# EAGLE design 32nbIoTrpi (EAGLE 9.0.0)
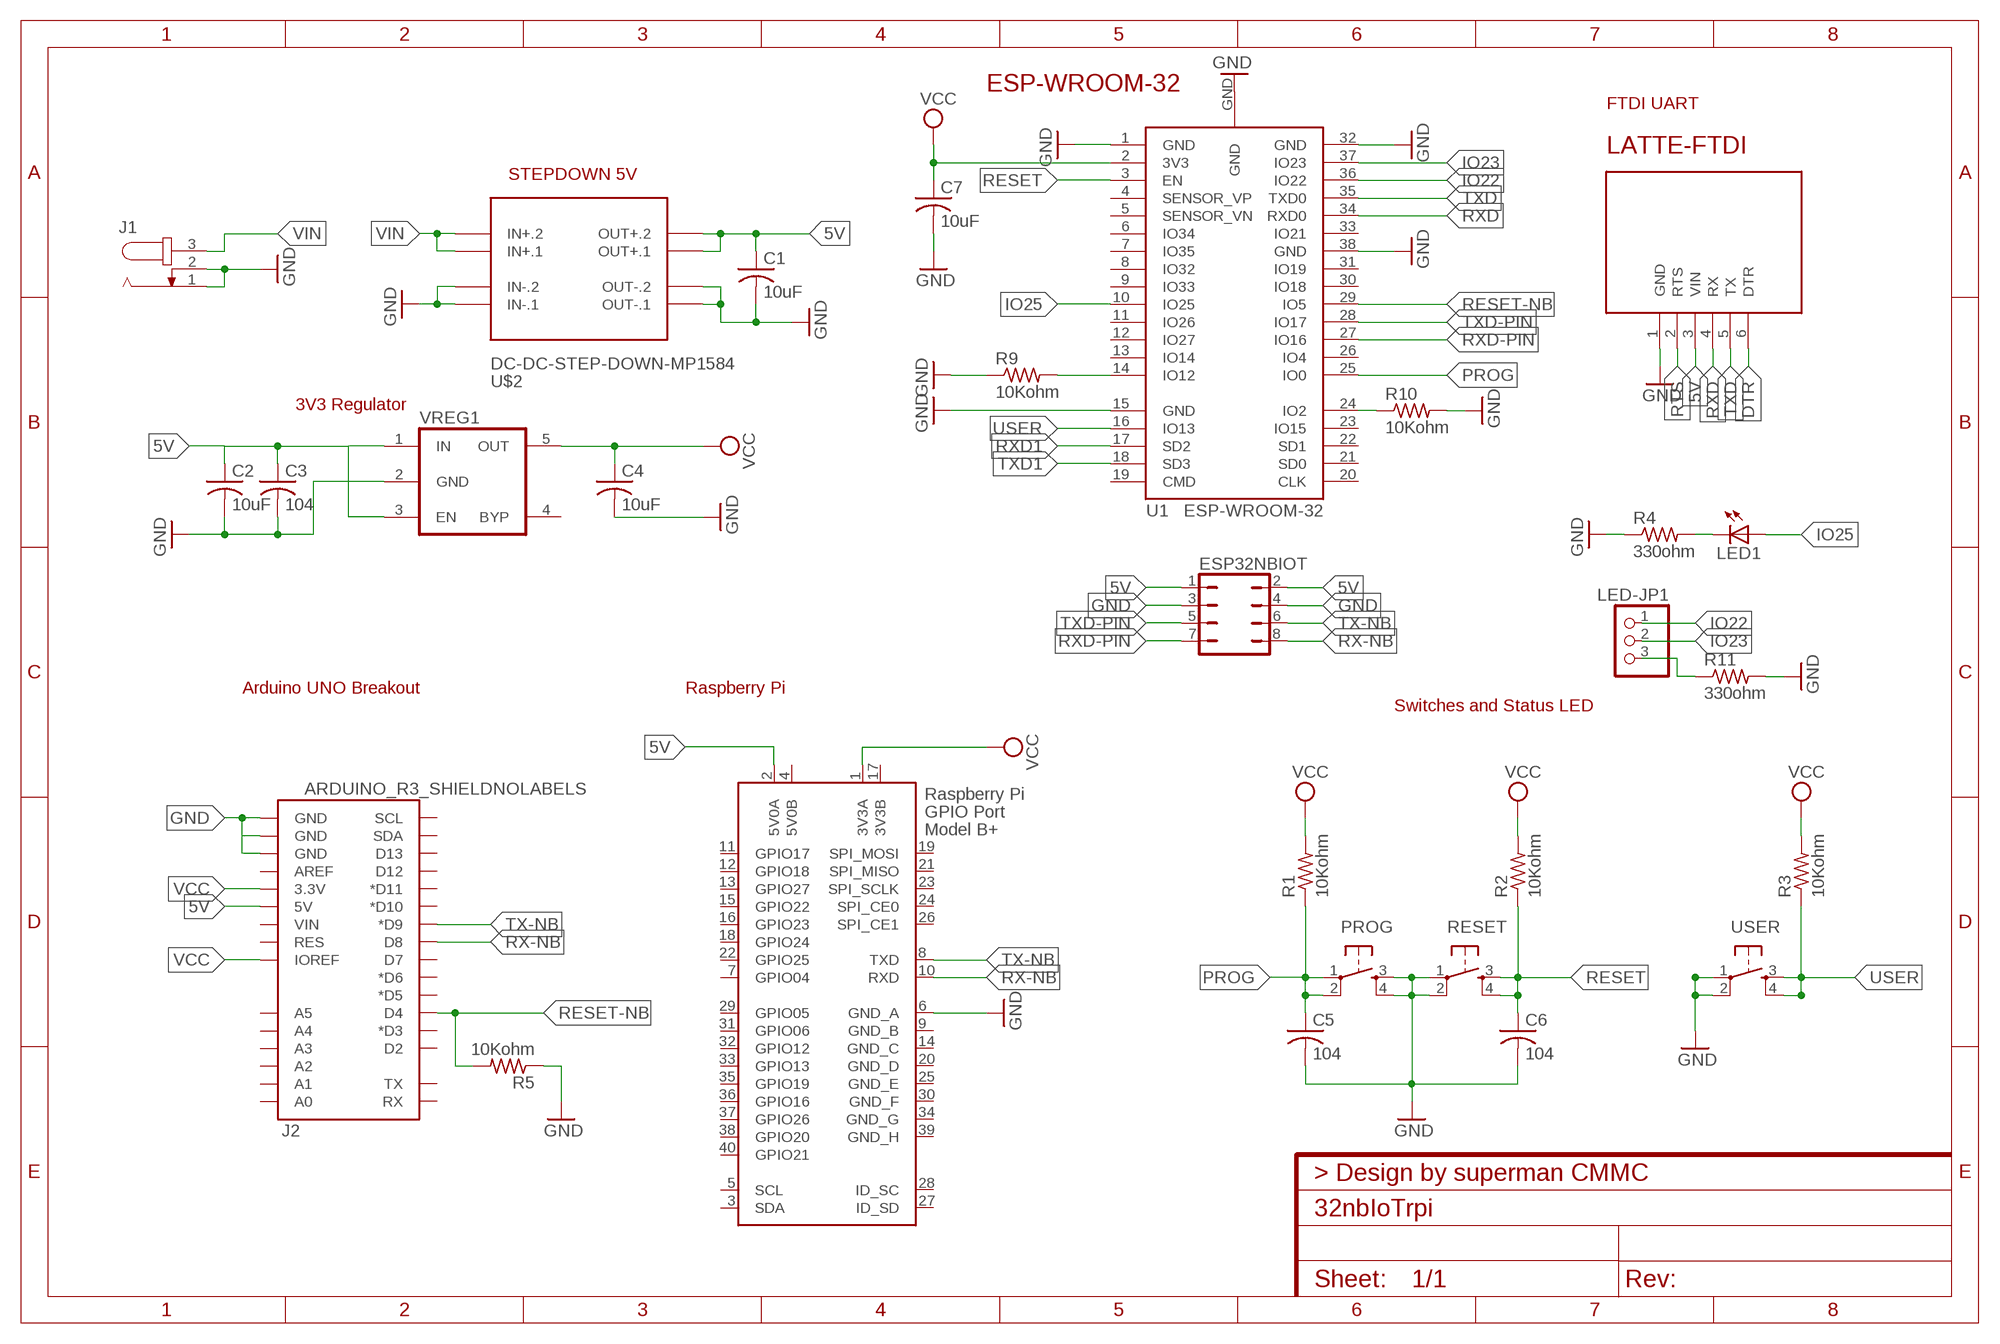
[diagram p0: schematic, sheet 1]

## Parts
C1  10uF  C-USC0805  [C0805]
C2  10uF  C-USC0805  [C0805]
C3  104  C-USC0805  [C0805]
C4  10uF  C-USC0805  [C0805]
C5  104  C-USC0805  [C0805]
C6  104  C-USC0805  [C0805]
C7  10uF  C-USC0805  [C0805]
ESP32NBIOT  JP4Q  [JP4Q]
J1  JACK-PLUG1  [SPC4078]
J2  ARDUINO_R3_SHIELDNOLABELS  [UNO_R3_SHIELD_NOLABELS]
LATTE-FTDI  FTDI  [CMMC-FTDI]
LED1  LEDCHIPLED_0805  [CHIPLED_0805]
LED-JP1  PINHD-1X3/90  [1X03/90]
PROG  TAC_SWITCHPTH  [TACTILE-PTH]
R1  10Kohm  R-US_R0805W  [R0805W]
R2  10Kohm  R-US_R0805W  [R0805W]
R3  10Kohm  R-US_R0805W  [R0805W]
R4  330ohm  R-US_R0805W  [R0805W]
R5  10Kohm  R-US_R0805W  [R0805W]
R9  10Kohm  R-US_R0805W  [R0805W]
R10  10Kohm  R-US_R0805W  [R0805W]
R11  330ohm  R-US_R0805W  [R0805W]
RESET  TAC_SWITCHPTH  [TACTILE-PTH]
U1  ESP-WROOM-32  [ESP-WROOM-32]
U$2  DC-DC-STEP-DOWN-MP1584  [DC-DC-STEP-DOWN-MP1584]
USER  TAC_SWITCHPTH  [TACTILE-PTH]
VREG1  VREG_5PINS-SOT-23-5  [SOT-23-5]
X2  RASPI_BOARD_B+#_E0  [RASPI_BOARD_B+_EDGES_0DRILL]

## Nets
5V: C1.1 C2.1 C3.1 ESP32NBIOT.1 ESP32NBIOT.2 J2.5V LATTE-FTDI.3(VIN) U$2.OUT+.1 U$2.OUT+.2 VREG1.1(IN) VREG1.3(EN) X2.2(5V0A)
DTR: LATTE-FTDI.6(DTR)
GND: C1.2 C2.2 C3.2 C4.2 C5.2 C6.2 C7.2 ESP32NBIOT.3 ESP32NBIOT.4 J1.1 J1.2 J2.GND@0(GND) J2.GND@1(GND) J2.GND@2(GND) LATTE-FTDI.1(GND) PROG.3 PROG.4 R4.1 R5.1 R9.1 R10.2 R11.2 RESET.1 RESET.2 U1.1(GND) U1.15(GND) U1.32(GND) U1.38(GND) U1.GND U$2.IN-.1 U$2.IN-.2 U$2.OUT-.1 U$2.OUT-.2 USER.1 USER.2 VREG1.2(GND) X2.6(GND_A)
IO22: LED-JP1.1 U1.36(IO22)
IO23: LED-JP1.2 U1.37(IO23)
IO25: LED1.A U1.10(IO25)
N$1: R10.1 U1.24(IO2)
N$2: R9.2 U1.14(IO12)
N$3: LED1.C R4.2
N$4: LED-JP1.3 R11.1
PROG: C5.1 PROG.1 PROG.2 R1.1 U1.25(IO0)
RESET: C6.1 R2.1 RESET.3 RESET.4 U1.3(EN)
RESET-NB: J2.D4 R5.2 U1.29(IO5)
RTS: LATTE-FTDI.2(RTS)
RX-NB: ESP32NBIOT.8 J2.D8 X2.10(RXD)
RXD: LATTE-FTDI.4(RX) U1.34(RXD0)
RXD1: U1.17(SD2)
RXD-PIN: ESP32NBIOT.7 U1.27(IO16)
TX-NB: ESP32NBIOT.6 J2.D9(*D9) X2.8(TXD)
TXD: LATTE-FTDI.5(TX) U1.35(TXD0)
TXD1: U1.18(SD3)
TXD-PIN: ESP32NBIOT.5 U1.28(IO17)
USER: R3.1 U1.16(IO13) USER.3 USER.4
VCC: C4.1 C7.1 J2.3.3V J2.IOREF R1.2 R2.2 R3.2 U1.2(3V3) VREG1.5(OUT) X2.1(3V3A)
VIN: J1.3 U$2.IN+.1 U$2.IN+.2
Unconnected: J2.A0 J2.A1 J2.A2 J2.A3 J2.A4 J2.A5 J2.AREF J2.D2 J2.D3(*D3) J2.D5(*D5) J2.D6(*D6) J2.D7 J2.D10(*D10) J2.D11(*D11) J2.D12 J2.D13 J2.RES J2.RX J2.SCL J2.SDA J2.TX J2.VIN U1.4(SENSOR_VP) U1.5(SENSOR_VN) U1.6(IO34) U1.7(IO35) U1.8(IO32) U1.9(IO33) U1.11(IO26) U1.12(IO27) U1.13(IO14) U1.19(CMD) U1.20(CLK) U1.21(SD0) U1.22(SD1) U1.23(IO15) U1.26(IO4) U1.30(IO18) U1.31(IO19) U1.33(IO21) VREG1.4(BYP) X2.3(SDA) X2.5(SCL) X2.7(GPIO04) X2.11(GPIO17) X2.12(GPIO18) X2.13(GPIO27) X2.15(GPIO22) X2.16(GPIO23) X2.18(GPIO24) X2.19(SPI_MOSI) X2.21(SPI_MISO) X2.22(GPIO25) X2.23(SPI_SCLK) X2.24(SPI_CE0) X2.26(SPI_CE1) X2.27(ID_SD) X2.28(ID_SC) X2.29(GPIO05) X2.31(GPIO06) X2.32(GPIO12) X2.33(GPIO13) X2.35(GPIO19) X2.36(GPIO16) X2.37(GPIO26) X2.38(GPIO20) X2.40(GPIO21)

## Notes on the sheet
- ESP-WROOM-32
- FTDI UART
- STEPDOWN 5V
- 3V3 Regulator
- Arduino UNO Breakout | Raspberry Pi
- Switches and Status LED

## Power pins joined to a net without a drawn wire
3V3B: X2.17(3V3B)
5V0B: X2.4(5V0B)
GND_B: X2.9(GND_B)
GND_C: X2.14(GND_C)
GND_D: X2.20(GND_D)
GND_E: X2.25(GND_E)
GND_F: X2.30(GND_F)
GND_G: X2.34(GND_G)
GND_H: X2.39(GND_H)

## Library data of the parts
C1-C7 = adafruit:C-US: CAPACITOR, American symbol
ESP32NBIOT = jumper:JP4Q: JUMPER
J1 = con-jack:JACK-PLUG: DC POWER JACK Power Jack, DC, Right Angle, Through Hole, Rated 5A at 16VDC, PC Terminals Distributor: Farnell (www.Farnell.de) Drawing: 84N1161.pdf / 84N1162.pdf Manufacturer: SPC Technology (www.spctechnology.com) Type: SPC4077 / SPC 4078; OC_FARNELL: unknown; OC_NEWARK: unknown
J2 = SparkFun-Boards:ARDUINO_R3_SHIELD: Shield form compatible with the Arduino Uno R3.
LATTE-FTDI = cmmc_ftdi:FTDI: cmmc-latte-ftdi
LED1 = adafruit:LED: LED OSRAM: - CHIPLED LG R971, LG N971, LY N971, LG Q971, LY Q971, LO R971, LY R971 LH N974, LH R974 LS Q976, LO Q976, LY Q976 LO Q996 - Hyper CHIPLED LW Q18S LB Q993, LB Q99A, LB R99A - SideLED LS A670, LO A670, LY A670, LG A670, LP A670 LB A673, LV A673, LT A673, LW A673 LH A674 LY A675 LS A676, LA A676, LO A676, LY A676, LW A676 LS A679, LY A679, LG A679 - Hyper Micro SIDELED® LS Y876, LA Y876, LO Y876, LY Y876 LT Y87S - SmartLED LW L88C, LW L88S LB L89C, LB L89S, LG L890 LS L89K, LO L89K, LY L89K LS L896, LA L896, LO L896, LY L896 - TOPLED LS T670, LO T670, LY T670, LG T670, LP T670 LSG T670, LSP T670, LSY T670, LOP T670, LYG T670 LG T671, LOG T671, LSG T671 LB T673, LV T673, LT T673, LW T673 LH T674 LS T676, LA T676, LO T676, LY T676, LB T676, LH T676, LSB T676, LW T676 LB T67C, LV T67C, LT T67C, LS T67K, LO T67K, LY T67K, LW E67C LS E67B, LA E67B, LO E67B, LY E67B, LB E67C, LV E67C, LT E67C LW T67C LS T679, LY T679, LG T679 LS T770, LO T770, LY T770, LG T770, LP T770 LB T773, LV T773, LT T773, LW T773 LH T774 LS E675, LA E675, LY E675, LS T675 LS T776, LA T776, LO T776, LY T776, LB T776 LHGB T686 LT T68C, LB T68C - Hyper Mini TOPLED® LB M676 - Mini TOPLED Santana® LG M470 LS M47K, LO M47K, LY M47K Source: http://www.osram.convergy.de/
LED-JP1 = pinhead:PINHD-1X3: PIN HEADER
PROG RESET USER = SparkFun-Retired:TAC_SWITCH: Momentary Switch Button commonly used for reset or general input. Spark Fun Electronics SKU : COM-00097 SMT- SWCH-08247
R1-R5 R9-R11 = adafruit:R-US_: RESISTOR, American symbol
U1 = esp32:ESP-WROOM-32: Espressif Systems ESP-WROOM-32
U$2 = diy-modules:DC-DC-STEP-DOWN-MP1584: DC/DC Step-Down Regulator based on MP1584 chip MP1584 datasheet available here: http://www.haoyuelectronics.com/Attachment/MP1584/MP1584.pdf Click here to find device on ebay.com <http://www.ebay.com/sch/mp1584+module>
VREG1 = dp_devices:VREG_5PINS: 5 pins voltage regulator
X2 = raspberrypi_bastelstube_v13:RASPI_BOARD_B+#: Raspberry Pi GPIO connector with markings for the outer dimensions of the Raspberry Pi board model B+ with different sets of drill holes or mounting pads All pins connected

## Board
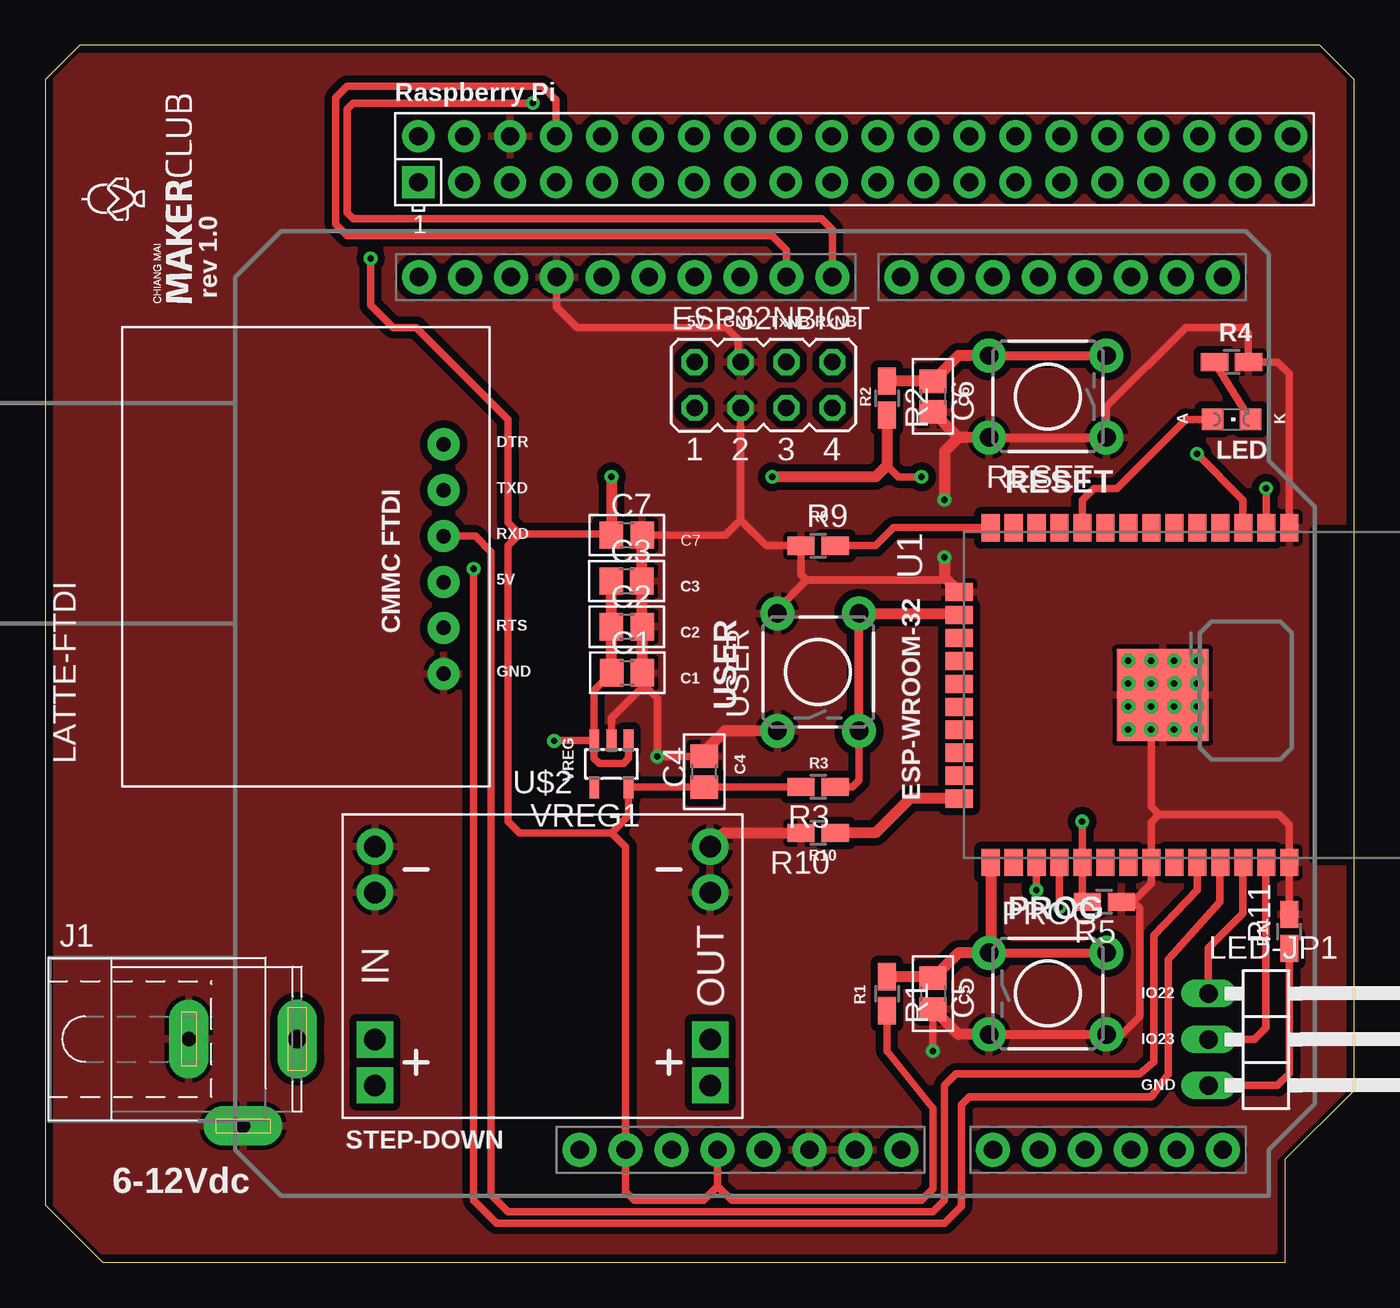
[diagram p1: board, top side]
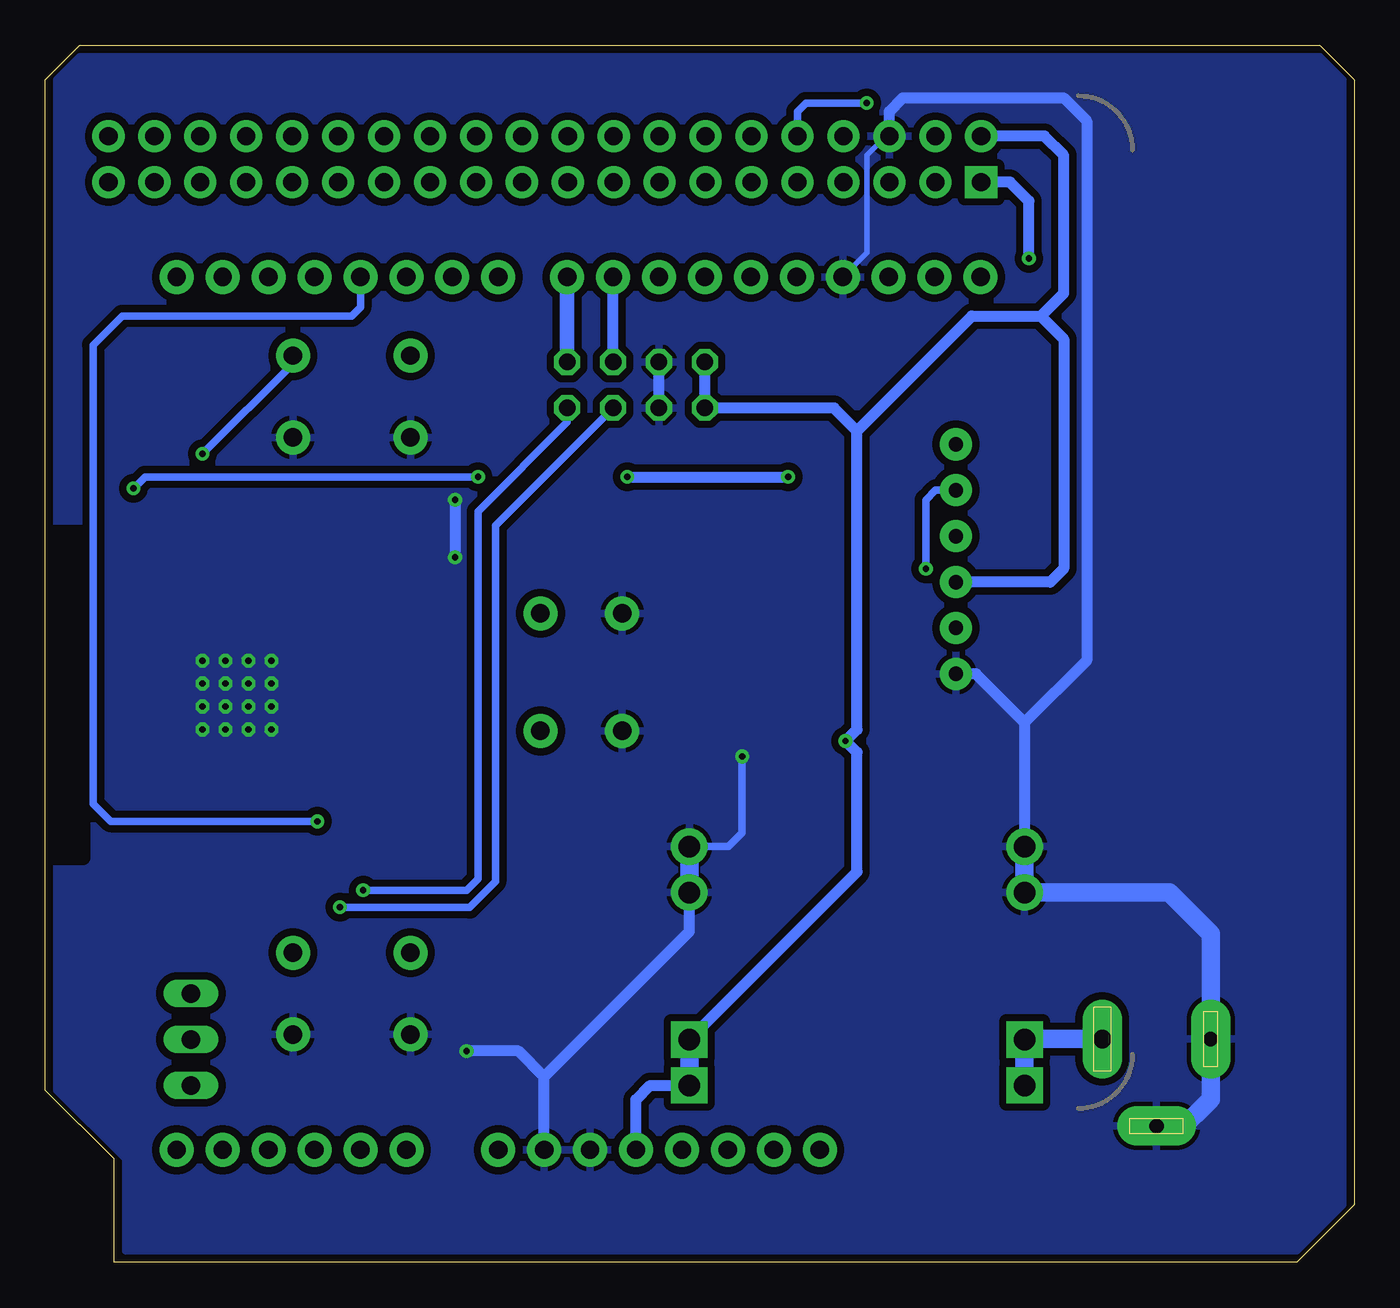
[diagram p2: board, bottom side, seen from below]

Size 72.39 x 67.31 mm. Coordinates in mm from the lower left corner, seen from the top.
Outline: 0,3.17 3.17,0 68.58,0 68.58,5.71 72.39,9.53 72.39,65.41 70.48,67.31 1.91,67.31 0,65.41 0,3.17
Copper layers (1*16): Top 0.035mm / dielectric 1.5mm / Bottom 0.035mm
Design rules "default *": minimum track width 6mil, minimum drill 0.35mm, track to track 6mil, track to pad 6mil, pad to pad 6mil, via to via 6mil, smd to smd 6mil, copper to edge 0mil, drill to drill 6mil, minimum pad ring 10mil, minimum via ring 8mil, stop-mask expansion 2mil, vias tented up to drill 26mil, thermal gap 10mil

### Footprints (pad centres in the part's own frame; a part is rotated, then mirrored left to right if it is on the bottom)
C0805 = smd 1.3 x 1.5: 1 -0.85,0; 2 0.85,0
JP4Q = drill 0.914 octagon: 1 -3.81,-1.27; 2 -3.81,1.27; 3 -1.27,-1.27; 4 -1.27,1.27; 5 1.27,-1.27; 6 1.27,1.27; 7 3.81,-1.27; 8 3.81,1.27
SPC4078 = drill 0.8 pad 2.184 long: 1 -3,0; 2 0,-4.8 | drill 1 pad 2.184 long: 3 3,0
UNO_R3_SHIELD_NOLABELS = drill 1.016 pad 1.88: 3.3V 50.8,26.67; 5V 50.8,29.21; A0 50.8,41.91; A1 50.8,44.45; A2 50.8,46.99; A3 50.8,49.53; A4 50.8,52.07; A5 50.8,54.61; AREF 2.54,15.24; D2 2.54,49.53; D3 2.54,46.99; D4 2.54,44.45; D5 2.54,41.91; D6 2.54,39.37; D7 2.54,36.83; D8 2.54,33.02; D9 2.54,30.48; D10 2.54,27.94; D11 2.54,25.4; D12 2.54,22.86; D13 2.54,20.32; GND@0 50.8,31.75; GND@1 50.8,34.29; GND@2 2.54,17.78; IOREF 50.8,21.59; NC 50.8,19.05; RES 50.8,24.13; RX 2.54,54.61; SCL 2.54,10.16; SDA 2.54,12.7; TX 2.54,52.07; VIN 50.8,36.83
CMMC-FTDI = drill 0.8 pad 1.778: 1 6.223,2.54; 2 8.763,2.54; 3 11.303,2.54; 4 13.843,2.54; 5 16.383,2.54; 6 18.923,2.54
CHIPLED_0805 = smd 1.2 x 1.2: A 0,-1.05; C 0,1.05
1X03/90 = drill 1.016 long: 1 -2.54,-3.81; 2 0,-3.81; 3 2.54,-3.81
TACTILE-PTH = drill 1.016 pad 1.88: 1 -3.251,2.261; 2 3.251,2.261; 3 -3.251,-2.261; 4 3.251,-2.261
R0805W = smd 1.5 x 1: 1 -0.94,0; 2 0.94,0
ESP-WROOM-32 = smd 1.5 x 1: 1 -9.25,7; 2 -9.25,5.73; 3 -9.25,4.46; 4 -9.25,3.19; 5 -9.25,1.92; 6 -9.25,0.65; 7 -9.25,-0.62; 8 -9.25,-1.89; 9 -9.25,-3.16; 10 -9.25,-4.43; 11 -9.25,-5.7; 12 -9.25,-6.97; 13 -9.25,-8.24; 14 -9.25,-9.51; 25 9.25,-9.51; 26 9.25,-8.24; 27 9.25,-6.97; 28 9.25,-5.7; 29 9.25,-4.43; 30 9.25,-3.16; 31 9.25,-1.89; 32 9.25,-0.62; 33 9.25,0.65; 34 9.25,1.92; 35 9.25,3.19; 36 9.25,4.46; 37 9.25,5.73; 38 9.25,7 | smd 1 x 1.5: 15 -5.7,-11.25; 16 -4.43,-11.25; 17 -3.16,-11.25; 18 -1.89,-11.25; 19 -0.62,-11.25; 20 0.65,-11.25; 21 1.92,-11.25; 22 3.19,-11.25; 23 4.46,-11.25; 24 5.73,-11.25 | smd 5.08 x 5.08: GND 0,0
DC-DC-STEP-DOWN-MP1584 = drill 1.2 pad 2 square: IN+.1 -9.271,-4.064; IN+.2 -9.271,-6.604; OUT+.1 9.271,-4.064; OUT+.2 9.271,-6.604 | drill 1.2 pad 2: IN-.1 -9.271,6.604; IN-.2 -9.271,4.064; OUT-.1 9.271,6.604; OUT-.2 9.271,4.064
SOT-23-5 = smd 0.55 x 1.2: 1 -0.95,-1.3; 2 0,-1.3; 3 0.95,-1.3; 4 0.95,1.3; 5 -0.95,1.3
RASPI_BOARD_B+_EDGES_0DRILL = drill 1 pad 1.778 square: 1 8.37,51.23 | drill 1 pad 1.778: 2 8.37,53.77; 3 10.91,51.23; 4 10.91,53.77; 5 13.45,51.23; 6 13.45,53.77; 7 15.99,51.23; 8 15.99,53.77; 9 18.53,51.23; 10 18.53,53.77; 11 21.07,51.23; 12 21.07,53.77; 13 23.61,51.23; 14 23.61,53.77; 15 26.15,51.23; 16 26.15,53.77; 17 28.69,51.23; 18 28.69,53.77; 19 31.23,51.23; 20 31.23,53.77; 21 33.77,51.23; 22 33.77,53.77; 23 36.31,51.23; 24 36.31,53.77; 25 38.85,51.23; 26 38.85,53.77; 27 41.39,51.23; 28 41.39,53.77; 29 43.93,51.23; 30 43.93,53.77; 31 46.47,51.23; 32 46.47,53.77; 33 49.01,51.23; 34 49.01,53.77; 35 51.55,51.23; 36 51.55,53.77; 37 54.09,51.23; 38 54.09,53.77; 39 56.63,51.23; 40 56.63,53.77

### Placement (x,y rotation side)
C1  32.18,32.61 0 top
C2  32.16,35.15 0 top
C3  32.15,37.67 0 top
C4  36.44,27.13 90 top
C5  49.09,14.86 270 top
C6  49.09,47.88 270 top
C7  32.17,40.22 0 top
ESP32NBIOT  39.72,48.52 0 top
J1  10.94,12.35 0 top
J2  10.51,57.03 270 top
LATTE-FTDI  24.57,26.32 90 top
LED1  65.6,46.61 270 top
LED-JP1  68.14,12.32 270 top
PROG  55.44,14.86 0 top
R1  46.55,14.86 270 top
R2  46.55,47.79 270 top
R3  42.74,26.29 180 top
R4  65.6,49.79 180 top
R5  58.56,19.94 180 top
R9  42.74,39.63 0 top
R10  42.74,23.75 180 top
R11  68.79,18.3 90 top
RESET  55.44,47.88 180 top
U1  61.79,31.37 270 top
U$2  27.5,16.39 0 top
USER  42.74,32.64 90 top
VREG1  31.31,27.56 180 top
X2  12.26,8.51 0 top

### Tracks (layer width: path | path; a pad name or v marks a point on that pad's centre or on a via)
5V  (via drill 0.35)
  Top 0.406: VREG1.3 30.36,27.87 30.64,27.59 30.65,27.6 31.98,27.6 32.26,27.89 VREG1.1 | VREG1.3 30.36,31.64 C1.1 | v28.14,28.83 28.17,28.86 VREG1.3
  Top 0.61: C1.1 31.33,35.14 C2.1 31.31,37.66 C3.1
  Bottom 0.61: J2.5V 39.72,9 38.93,9.78 U$2.OUT+.2 | U$2.OUT+.1 27.5,21.59 27.5,28.2 v28.14,28.83 27.5,29.47 27.5,45.98 | 27.5,45.98 28.77,47.25 ESP32NBIOT.1 ESP32NBIOT.2 | 27.5,45.98 21.15,52.33 17.34,52.33 | 17.34,52.33 16.07,51.06 16.07,38.36 16.81,37.62 LATTE-FTDI.3 | 17.34,52.33 16.07,53.6 16.07,61.22 17.14,62.28 X2.2
  Bottom 1.016: U$2.OUT+.1 U$2.OUT+.2
GND  (via drill 0.35)
  Top 0.406: VREG1.2 31.31,30.1 33.03,31.82 33.03,32.01 | ESP32NBIOT.3 38.45,41.05 | C7.2 37.61,40.22 38.45,41.05 | 42.11,37.72 41.8,38.03 R9.1 39.87,39.63 38.45,41.05 | U1.15 50.44,37.17 49.89,37.72 42.11,37.72 | USER.2 40.48,36.1 42.11,37.72 | ESP32NBIOT.4 38.3,49.94 38.3,51.06 37.66,51.69 29.41,51.69 28.29,52.81 J2.GND@2 | R11.2 U1.38 68.79,24.19 68.22,24.76 61.59,24.76 | C5.2 v49.09,11.69 | RESET.1 58.69,47.33 63.06,51.69 66.24,51.69 66.54,51.39 R4.1 68.14,49.79 68.79,49.14 U1.1 | 58.62,12.6 59.53,12.6 60.52,13.59 60.52,19.57 60.16,19.94 | C4.2 v33.85,27.98 33.85,31.19 33.03,32.01 | 33.03,32.01 C1.2 | 61.59,24.76 61.17,24.34 U1.32 61.17,20.95 60.16,19.94 | 61.59,24.76 61.16,25.2 v61.16,29.47 | R5.1 60.16,19.94
  Top 0.508: RESET.2 RESET.1 | PROG.3 58.62,12.6 PROG.4
  Top 0.61: R10.2 37.53,23.75 U$2.OUT-.1 36.77,23.11 36.76,23.12 | USER.1 37.59,29.39 36.44,28.25 C4.2 | 33.03,32.3 C1.2 33.03,35.14 C2.2 33.01,37.66 C3.2 33.02,37.69 C7.2 | PROG.3 50.5,12.6 C5.2 | RESET.2 50.5,45.62 | 50.5,45.62 C6.2 | 50.5,45.62 49.73,44.85 v49.73,42.17 | v49.73,38.99 49.73,37.89 50.44,37.17
  Bottom 0.305: J2.GND@2 26.95,55.83 26.95,61.22 25.88,62.28 X2.6
  Bottom 0.406: U$2.OUT-.1 34.61,22.99 33.85,23.75 v33.85,27.98
  Bottom 0.61: J2.GND@1 44.8,10.27 | U$2.OUT-.2 36.77,18.29 44.8,10.27 | ESP32NBIOT.3 ESP32NBIOT.4 | X2.6 25.71,63.64 24.96,64.39 16.07,64.39 14.8,63.12 14.8,33.28 18.23,29.85 | 44.8,10.27 46.22,11.69 v49.09,11.69 | v49.73,42.17 v49.73,38.99 | 18.23,29.85 U$2.IN-.1 | 18.23,29.85 20.92,32.54 LATTE-FTDI.1
  Bottom 1.016: J1.2 10.03,7.55 9.72,7.24 7.94,9.03 J1.1 7.94,18.16 10.23,20.45 U$2.IN-.2 U$2.IN-.1 18.22,23 | U$2.OUT-.2 U$2.OUT-.1
  other vias: 59.89,33.28 61.16,33.28 62.43,33.28 63.7,33.28 62.43,32.01 61.16,32.01 61.16,30.74 62.43,30.74 63.7,30.74 59.89,29.47 62.43,29.47 59.89,30.74 59.89,32.01 63.7,32.01 63.7,29.47
  pour Top (isolate 0.406): 0.64,3.17 3.17,0.64 67.95,0.64 67.95,5.71 71.76,9.53 71.76,62.87 71.76,64.13 71.76,65.41 70.48,66.67 1.91,66.67 0.64,65.41
  pour Bottom (isolate 0.406): 1.91,66.67 0.64,65.41 0.64,3.17 3.17,0.64 67.95,0.64 67.95,5.71 71.76,9.53 71.76,65.41 70.48,66.67
IO22
  Top 0.406: U1.36 66.24,22.11 66.24,19.31 64.33,17.4 LED-JP1.1
IO23
  Top 0.406: U1.37 67.51,22.11 67.51,12.96 66.87,12.32 LED-JP1.2
IO25
  Top 0.406: 57.35,40.64 57.35,42.17 57.98,42.8 59.25,42.8 63.06,46.61 LED1.A
  Top 0.61: U1.10 57.35,40.64
N$1
  Top 0.61: U1.24 47.81,25.64 45.92,23.75 R10.1
N$2
  Top 0.406: U1.14 46.91,40.62 45.92,39.63 R9.2
N$3
  Top 0.406: LED1.C R4.2
N$4
  Top 0.406: R11.1 68.79,10.43 68.14,9.78 LED-JP1.3
PROG
  Top 0.508: PROG.1 PROG.2
  Top 0.61: R1.1 49,15.8 C5.1 50.5,17.12 PROG.1 52.28,17.22 U1.25
RESET  (via drill 0.35)
  Top 0.406: 66.24,40.64 66.24,42.17 v63.7,44.71
  Top 0.508: RESET.4 RESET.3
  Top 0.61: R2.1 C6.1 50.5,50.15 RESET.4 | U1.3 66.24,40.64
  Bottom 0.406: v63.7,44.71 58.69,49.71 RESET.3
RESET-NB  (via drill 0.35)
  Top 0.406: v57.35,24.39 57.35,22.14 U1.29 57.36,20.2 R5.2
  Bottom 0.406: J2.D4 54.96,52.81 55.44,52.33 68.14,52.33 69.75,50.73 69.75,25.36 68.78,24.39 v57.35,24.39
RX-NB  (via drill 0.35)
  Top 0.406: J2.D8 43.53,57.11 42.93,57.71 17.04,57.71 16.71,58.04 16.71,63.76 17.04,64.09 26.95,64.09 v26.96,64.11
  Bottom 0.406: v26.96,64.11 30.33,64.11 30.79,63.64 X2.10
  Bottom 0.813: ESP32NBIOT.8 J2.D8
RXD
  Top 0.406: U1.34 63.71,20.59 61.32,18.07 61.32,11.09 60.52,10.42 50.36,10.42 49.73,9.78 49.73,3.43 49.09,2.8 25.6,2.8 24.66,3.74 24.66,39.3 23.79,40.16 LATTE-FTDI.4
RXD-PIN  (via drill 0.35)
  Top 0.406: U1.27 54.82,20.59 v54.81,20.58
  Bottom 0.406: v54.81,20.58 49.09,20.58 48.46,21.21 48.46,41.53 43.53,46.46 ESP32NBIOT.7
TX-NB
  Top 0.406: J2.D9 40.99,55.99 40.2,56.77 16.71,56.77 16.07,57.41 16.07,64.39 16.71,65.03 27.5,65.03 28.25,64.28 X2.8
  Bottom 0.61: ESP32NBIOT.6 J2.D9
TXD  (via drill 0.35)
  Top 0.406: U1.35 64.97,22.11 64.97,19.94 62.09,16.75 62.09,10.4 61.16,9.15 51.11,9.15 50.66,8.71 50.66,3.1 49.73,2.16 24.96,2.16 23.69,3.43 v23.69,38.36
  Bottom 0.406: v23.69,38.36 23.69,42.17 23.16,42.7 LATTE-FTDI.5
TXD-PIN  (via drill 0.35)
  Top 0.406: v56.09,19.64 U1.28
  Bottom 0.406: ESP32NBIOT.5 47.49,40.75 47.49,21.06 48.92,19.63 56.08,19.63 v56.09,19.64
USER
  Top 0.406: USER.3 45,26.65 44.65,26.29 R3.1
  Top 0.508: USER.3 USER.4
  Top 0.61: USER.4 50.45,35.9 U1.16
VCC  (via drill 0.35)
  Top 0.406: 37.18,4.22 36.39,3.43 32.58,3.43 32.1,3.92 J2.IOREF 32.1,22.97 31.31,23.75 | 37.18,4.22 J2.3.3V | 37.18,4.22 37.97,3.43 48.46,3.43 49.09,4.07 49.09,8.51 46.55,11.69 R1.2 | 41.74,26.24 R3.2 41.79,26.28 C4.1 36.43,26.29 32.29,26.29 VREG1.5 32.26,24.7 31.31,23.75 | C7.1 31.27,40.26 26.23,40.26 | v17.99,55.52 17.99,52.95 19.25,51.69 20.52,51.69 25.6,46.61 25.6,40.9 26.23,40.26 | 46.55,44.07 47.19,43.44 v48.46,43.44 | v67.51,42.8 67.52,42.79 U1.2 | 26.23,40.26 25.6,39.63 25.6,24.39 26.23,23.75 31.31,23.75
  Top 0.61: 17.98,55.5 v17.99,55.52 | R2.2 46.55,44.07 45.92,43.44 v40.2,43.44 | v31.31,43.44 C7.1
  Bottom 0.406: v48.46,43.44 66.87,43.44 v67.51,42.8
  Bottom 0.61: v17.99,55.52 17.99,58.7 19.04,59.74 X2.1 | v40.2,43.44 v31.31,43.44
VIN
  Bottom 1.016: U$2.IN+.2 U$2.IN+.1 18.23,12.35 J1.3

### Text on the board
tPlace: Raspberry Pi | rev 1.0 | 5V | GND | TxNB | RxNB | R4 | R2 | C6 | A | K | DTR | LED | TXD | RESET | R9 | RXD | C7 | 5V | C3 | RTS | CMMC FTDI | C2 | GND | C1 | USER | C4 | R3 | VREG | ESP-WROOM-32 | R10 | PROG | R11 | R1 | C5 | IO22 | IO23 | GND | STEP-DOWN | 6-12Vdc